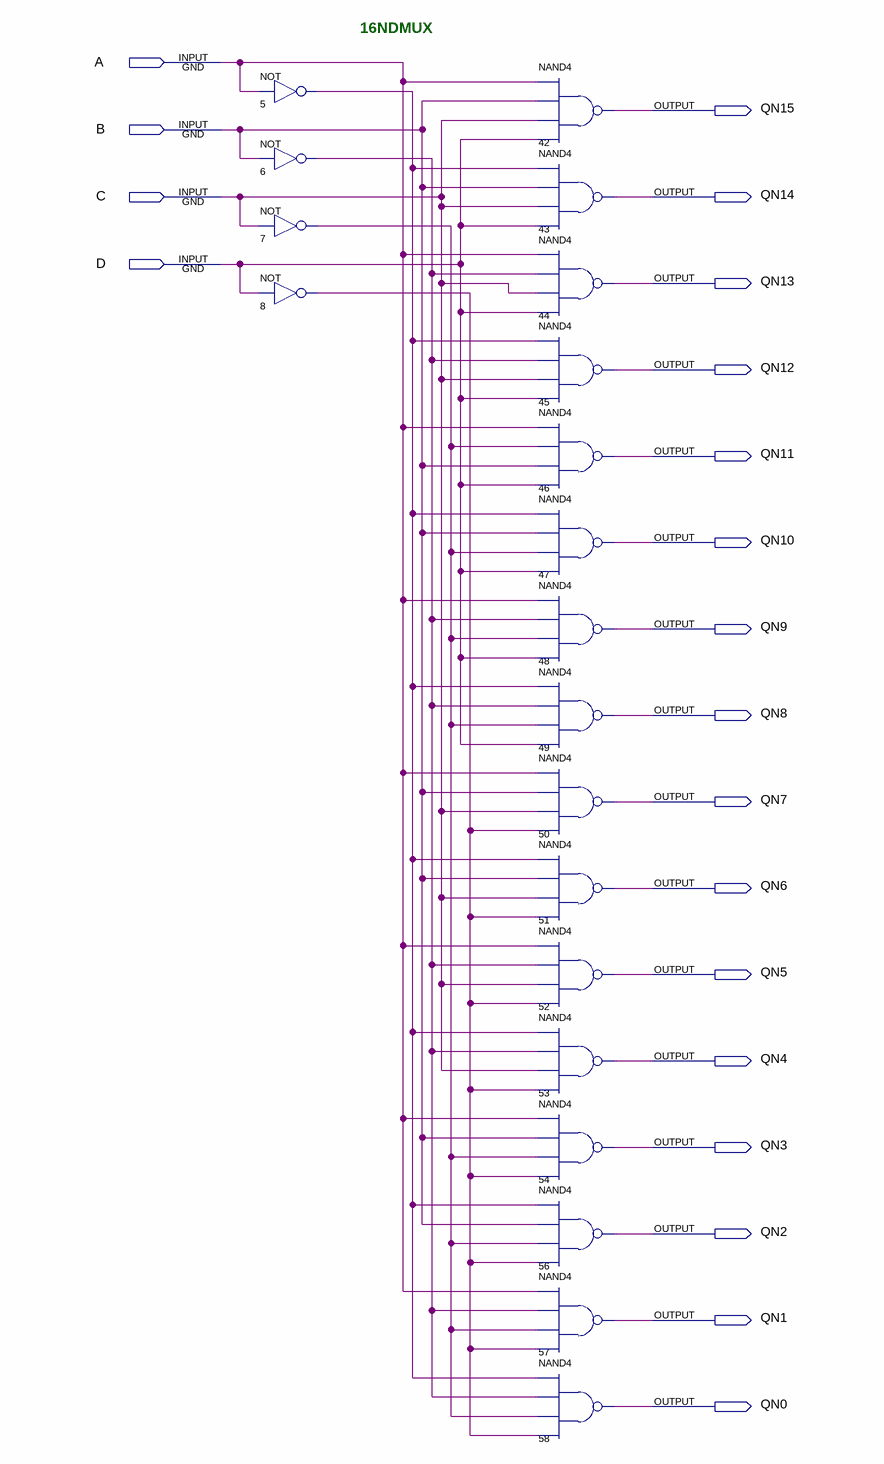
[diagram p0: schematic sheet]
// Quartus schematic 16ndmux.bdf as structural Verilog: 20 symbols, 20 pins
module \16ndmux  (
  input  A,
  input  B,
  input  C,
  input  D,
  output QN15,
  output QN14,
  output QN13,
  output QN12,
  output QN11,
  output QN10,
  output QN9,
  output QN8,
  output QN7,
  output QN6,
  output QN5,
  output QN4,
  output QN3,
  output QN2,
  output QN1,
  output QN0
);

  wire n5_out, n6_out, n7_out, n8_out;

  not u_5 (n5_out, A);
  not u_6 (n6_out, B);
  not u_7 (n7_out, C);
  not u_8 (n8_out, D);
  nand u_42 (QN15, A, B, C, D);
  nand u_43 (QN14, n5_out, B, C, D);
  nand u_44 (QN13, A, n6_out, C, D);
  nand u_45 (QN12, n5_out, n6_out, C, D);
  nand u_46 (QN11, A, n7_out, B, D);
  nand u_47 (QN10, n5_out, B, n7_out, D);
  nand u_48 (QN9, A, n6_out, n7_out, D);
  nand u_49 (QN8, n5_out, n6_out, n7_out, D);
  nand u_50 (QN7, A, B, C, n8_out);
  nand u_51 (QN6, n5_out, B, C, n8_out);
  nand u_52 (QN5, A, n6_out, C, n8_out);
  nand u_53 (QN4, n5_out, n6_out, C, n8_out);
  nand u_54 (QN3, A, B, n7_out, n8_out);
  nand u_56 (QN2, n5_out, B, n7_out, n8_out);
  nand u_57 (QN1, A, n6_out, n7_out, n8_out);
  nand u_58 (QN0, n5_out, n6_out, n7_out, n8_out);

  // Notes on the sheet:
  //   16NDMUX
endmodule
